# EAGLE design R601F (EAGLE 6.6.0)
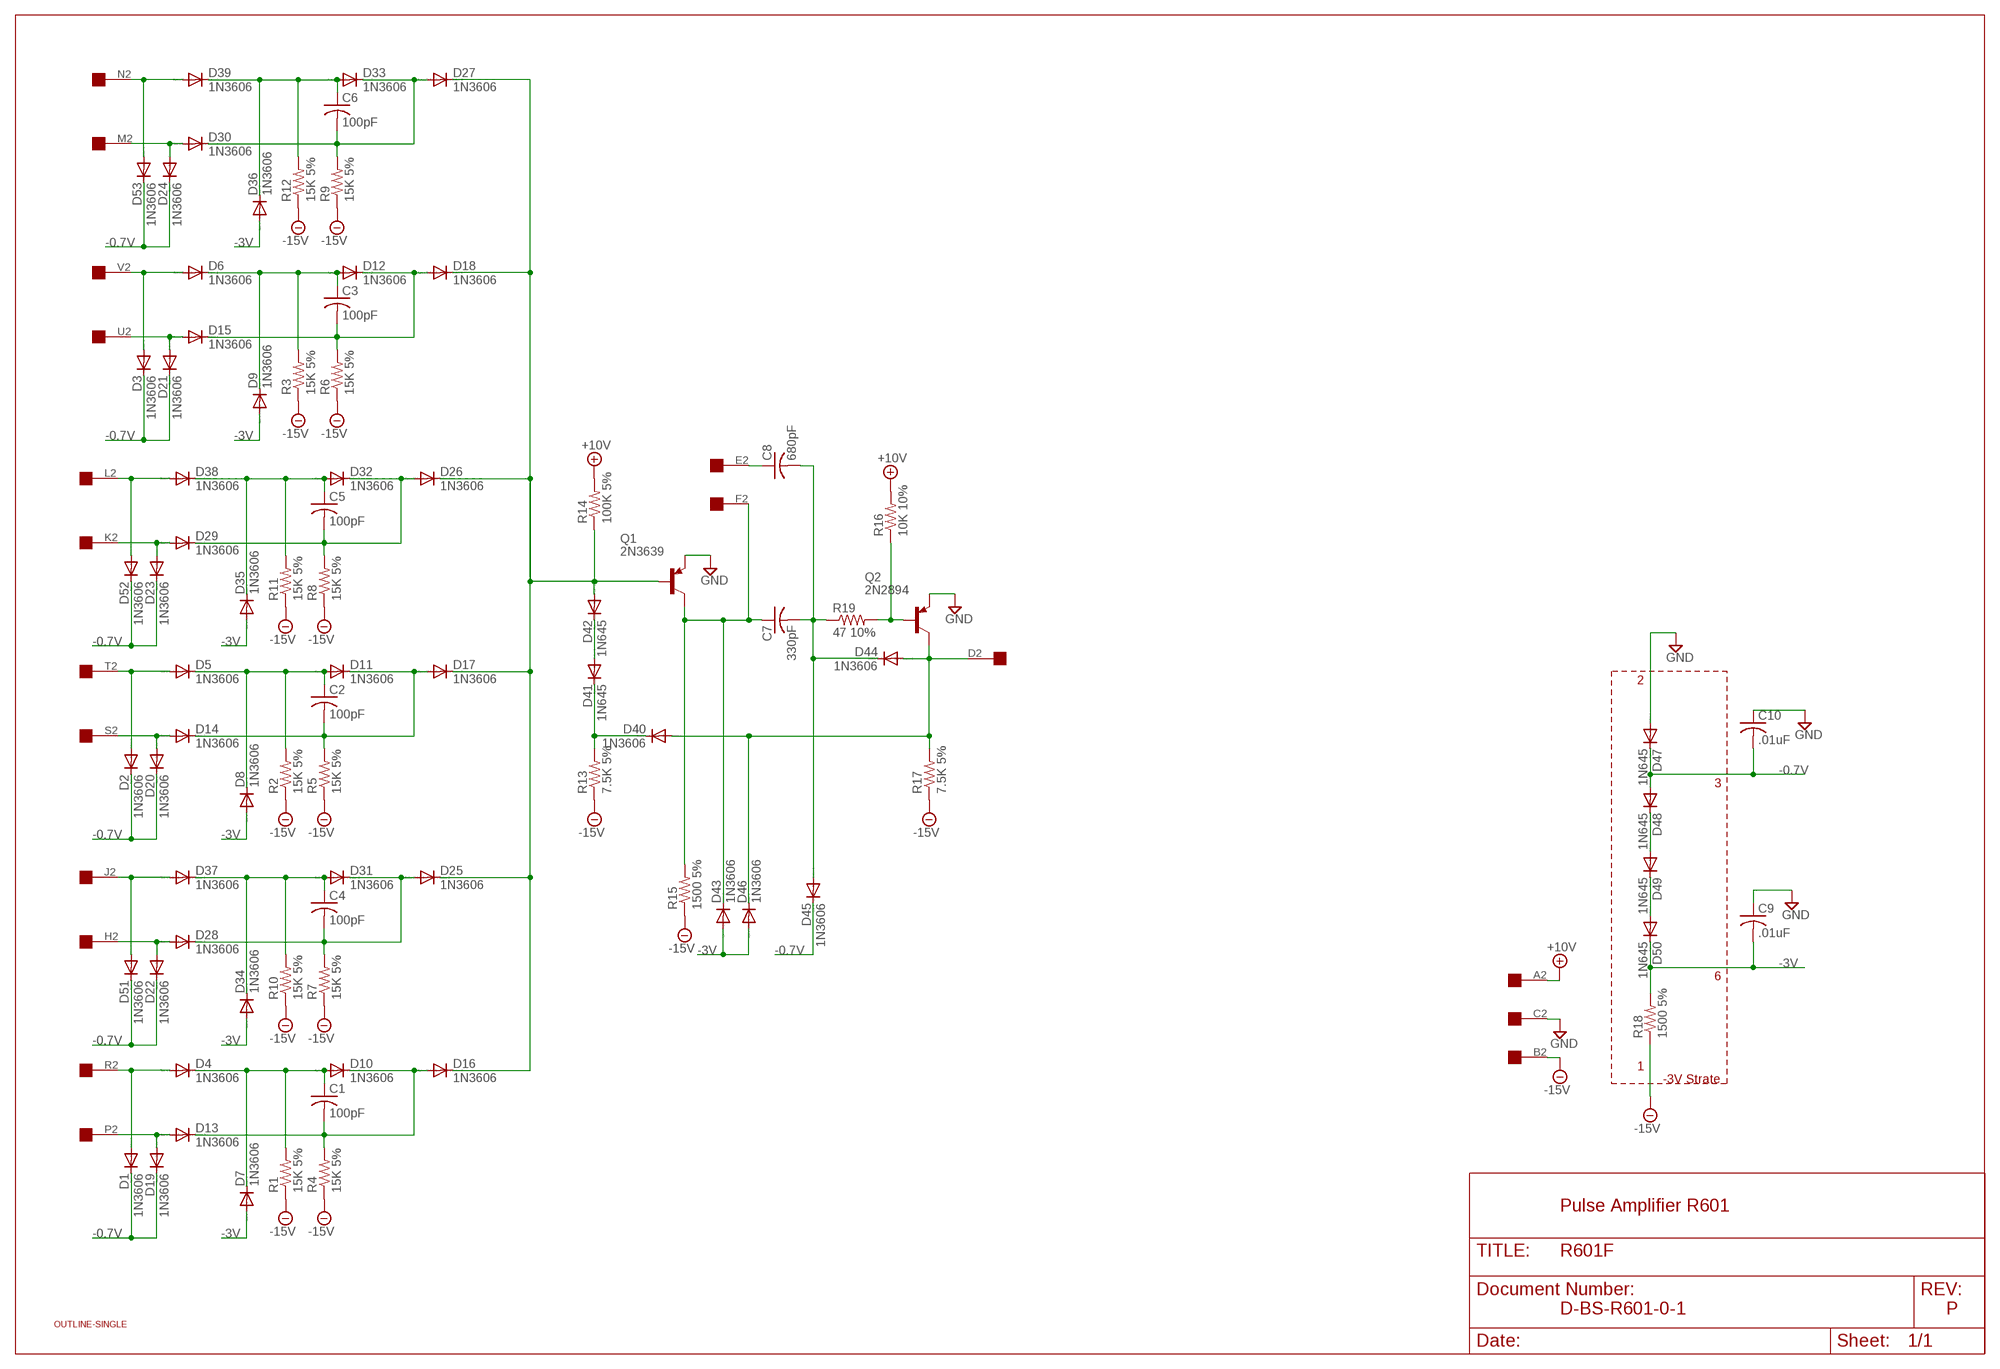
[diagram p0: schematic, sheet 1]

## Parts
C1  100pF  C-US050-025X075  [C050-025X075]
C2  100pF  C-US050-025X075  [C050-025X075]
C3  100pF  C-US050-025X075  [C050-025X075]
C4  100pF  C-US050-025X075  [C050-025X075]
C5  100pF  C-US050-025X075  [C050-025X075]
C6  100pF  C-US050-025X075  [C050-025X075]
C7  330pF  C-US050-025X075  [C050-025X075]
C8  680pF  C-US050-025X075  [C050-025X075]
C9  .01uF  C-US050-025X075  [C050-025X075]
C10  .01uF  C-US050-025X075  [C050-025X075]
D1  1N3606  1N4148DO35-10  [DO35-10]
D2  1N3606  1N4148DO35-10  [DO35-10]
D3  1N3606  1N4148DO35-10  [DO35-10]
D4  1N3606  1N4148DO35-10  [DO35-10]
D5  1N3606  1N4148DO35-10  [DO35-10]
D6  1N3606  1N4148DO35-10  [DO35-10]
D7  1N3606  1N4148DO35-10  [DO35-10]
D8  1N3606  1N4148DO35-10  [DO35-10]
D9  1N3606  1N4148DO35-10  [DO35-10]
D10  1N3606  1N4148DO35-10  [DO35-10]
D11  1N3606  1N4148DO35-10  [DO35-10]
D12  1N3606  1N4148DO35-10  [DO35-10]
D13  1N3606  1N4148DO35-10  [DO35-10]
D14  1N3606  1N4148DO35-10  [DO35-10]
D15  1N3606  1N4148DO35-10  [DO35-10]
D16  1N3606  1N4148DO35-10  [DO35-10]
D17  1N3606  1N4148DO35-10  [DO35-10]
D18  1N3606  1N4148DO35-10  [DO35-10]
D19  1N3606  1N4148DO35-10  [DO35-10]
D20  1N3606  1N4148DO35-10  [DO35-10]
D21  1N3606  1N4148DO35-10  [DO35-10]
D22  1N3606  1N4148DO35-10  [DO35-10]
D23  1N3606  1N4148DO35-10  [DO35-10]
D24  1N3606  1N4148DO35-10  [DO35-10]
D25  1N3606  1N4148DO35-10  [DO35-10]
D26  1N3606  1N4148DO35-10  [DO35-10]
D27  1N3606  1N4148DO35-10  [DO35-10]
D28  1N3606  1N4148DO35-10  [DO35-10]
D29  1N3606  1N4148DO35-10  [DO35-10]
D30  1N3606  1N4148DO35-10  [DO35-10]
D31  1N3606  1N4148DO35-10  [DO35-10]
D32  1N3606  1N4148DO35-10  [DO35-10]
D33  1N3606  1N4148DO35-10  [DO35-10]
D34  1N3606  1N4148DO35-10  [DO35-10]
D35  1N3606  1N4148DO35-10  [DO35-10]
D36  1N3606  1N4148DO35-10  [DO35-10]
D37  1N3606  1N4148DO35-10  [DO35-10]
D38  1N3606  1N4148DO35-10  [DO35-10]
D39  1N3606  1N4148DO35-10  [DO35-10]
D40  1N3606  1N4148DO35-10  [DO35-10]
D41  1N645  1N4148DO35-10  [DO35-10]
D42  1N645  1N4148DO35-10  [DO35-10]
D43  1N3606  1N4148DO35-10  [DO35-10]
D44  1N3606  1N4148DO35-10  [DO35-10]
D45  1N3606  1N4148DO35-10  [DO35-10]
D46  1N3606  1N4148DO35-10  [DO35-10]
D47  1N645  1N4148DO35-10  [DO35-10]
D48  1N645  1N4148DO35-10  [DO35-10]
D49  1N645  1N4148DO35-10  [DO35-10]
D50  1N645  1N4148DO35-10  [DO35-10]
D51  1N3606  1N4148DO35-10  [DO35-10]
D52  1N3606  1N4148DO35-10  [DO35-10]
D53  1N3606  1N4148DO35-10  [DO35-10]
Q1  2N3639  2N2904  [TO39]
Q2  2N2894  2N2904  [TO39]
R1  15K 5%  R-US_0207/10  [0207/10]
R2  15K 5%  R-US_0207/10  [0207/10]
R3  15K 5%  R-US_0207/10  [0207/10]
R4  15K 5%  R-US_0207/10  [0207/10]
R5  15K 5%  R-US_0207/10  [0207/10]
R6  15K 5%  R-US_0207/10  [0207/10]
R7  15K 5%  R-US_0207/10  [0207/10]
R8  15K 5%  R-US_0207/10  [0207/10]
R9  15K 5%  R-US_0207/10  [0207/10]
R10  15K 5%  R-US_0207/10  [0207/10]
R11  15K 5%  R-US_0207/10  [0207/10]
R12  15K 5%  R-US_0207/10  [0207/10]
R13  7.5K 5%  R-US_0207/10  [0207/10]
R14  100K 5%  R-US_0207/10  [0207/10]
R15  1500 5%  R-US_0207/10  [0207/10]
R16  10K 10%  R-US_0207/10  [0207/10]
R17  7.5K 5%  R-US_0207/10  [0207/10]
R18  1500 5%  R-US_0207/10  [0207/10]
R19  47 10%  R-US_0207/10  [0207/10]
U$1  OUTLINE-SINGLE  [SINGLE]
U$2  EDGE-1  [EDGE-CON1]

## Nets
+10V [Supply]: R14.2 R16.2 U$2.A2
-0.7V [Supply]: C10.2 D1.C D2.C D3.C D19.C D20.C D21.C D22.C D23.C D24.C D45.C D47.C D48.A D51.C D52.C D53.C
-3V [Supply]: C9.2 D7.A D8.A D9.A D34.A D35.A D36.A D43.A D46.A D50.C R18.2
-15V [Supply]: R1.1 R2.1 R3.1 R4.1 R5.1 R6.1 R7.1 R8.1 R9.1 R10.1 R11.1 R12.1 R13.1 R15.1 R17.1 R18.1 U$2.B2
GND [Supply]: C9.1 C10.1 D47.A Q1.1(E) Q2.1(E) U$2.C2
N$1: D37.A D51.A U$2.J2
N$2: D40.C D41.C R13.2
N$3: D39.A D53.A U$2.N2
N$4: D24.A D30.A U$2.M2
N$5: C6.1 D33.A D36.C D39.C R12.2
N$6: C6.2 D27.A D30.C D33.C R9.2
N$7: D41.A D42.C
N$8 [Supply]: D48.C D49.A
N$9 [Supply]: D49.C D50.A
N$10: D16.C D17.C D18.C D25.C D26.C D27.C D42.A Q1.2(B) R14.1
N$11: C7.1 D43.C Q1.3(C) R15.2 U$2.F2
N$12: C7.2 C8.2 D44.C D45.A R19.1
N$13: Q2.2(B) R16.1 R19.2
N$14: D40.A D44.A D46.C Q2.3(C) R17.2 U$2.D2
N$15: D3.A D6.A U$2.V2
N$16: D15.A D21.A U$2.U2
N$17: C3.1 D6.C D9.C D12.A R3.2
N$18: C3.2 D12.C D15.C D18.A R6.2
N$19: D38.A D52.A U$2.L2
N$20: D23.A D29.A U$2.K2
N$21: C5.1 D32.A D35.C D38.C R11.2
N$22: C5.2 D26.A D29.C D32.C R8.2
N$23: D22.A D28.A U$2.H2
N$24: C4.1 D31.A D34.C D37.C R10.2
N$25: C4.2 D25.A D28.C D31.C R7.2
N$26: D1.A D4.A U$2.R2
N$27: D13.A D19.A U$2.P2
N$28: C1.1 D4.C D7.C D10.A R1.2
N$29: C1.2 D10.C D13.C D16.A R4.2
N$30: C8.1 U$2.E2
N$31: D2.A D5.A U$2.T2
N$32: D14.A D20.A U$2.S2
N$33: C2.1 D5.C D8.C D11.A R2.2
N$34: C2.2 D11.C D14.C D17.A R5.2

## Notes on the sheet
- 2
- 3
- 6
- 1
- -3V Strate
- Pulse Amplifier R601
- D-BS-R601-0-1 | P

## Library data of the parts
C1-C10 = rcl:C-US: CAPACITOR, American symbol
D1-D53 = diode:1N4148: DIODE high speed (Philips)
Q1 Q2 = transistor-pnp:2N2904*: PNP Transistror
R1-R19 = rcl:R-US_: RESISTOR, American symbol
U$1 = dec-con:OUTLINE-*: Board outlines for DEC boards.
U$2 = dec-con:EDGE-1: Single-Sided DEC Edge Connector -- (side 2)

## Net classes
1 Supply: width 0.813 mm

## Board
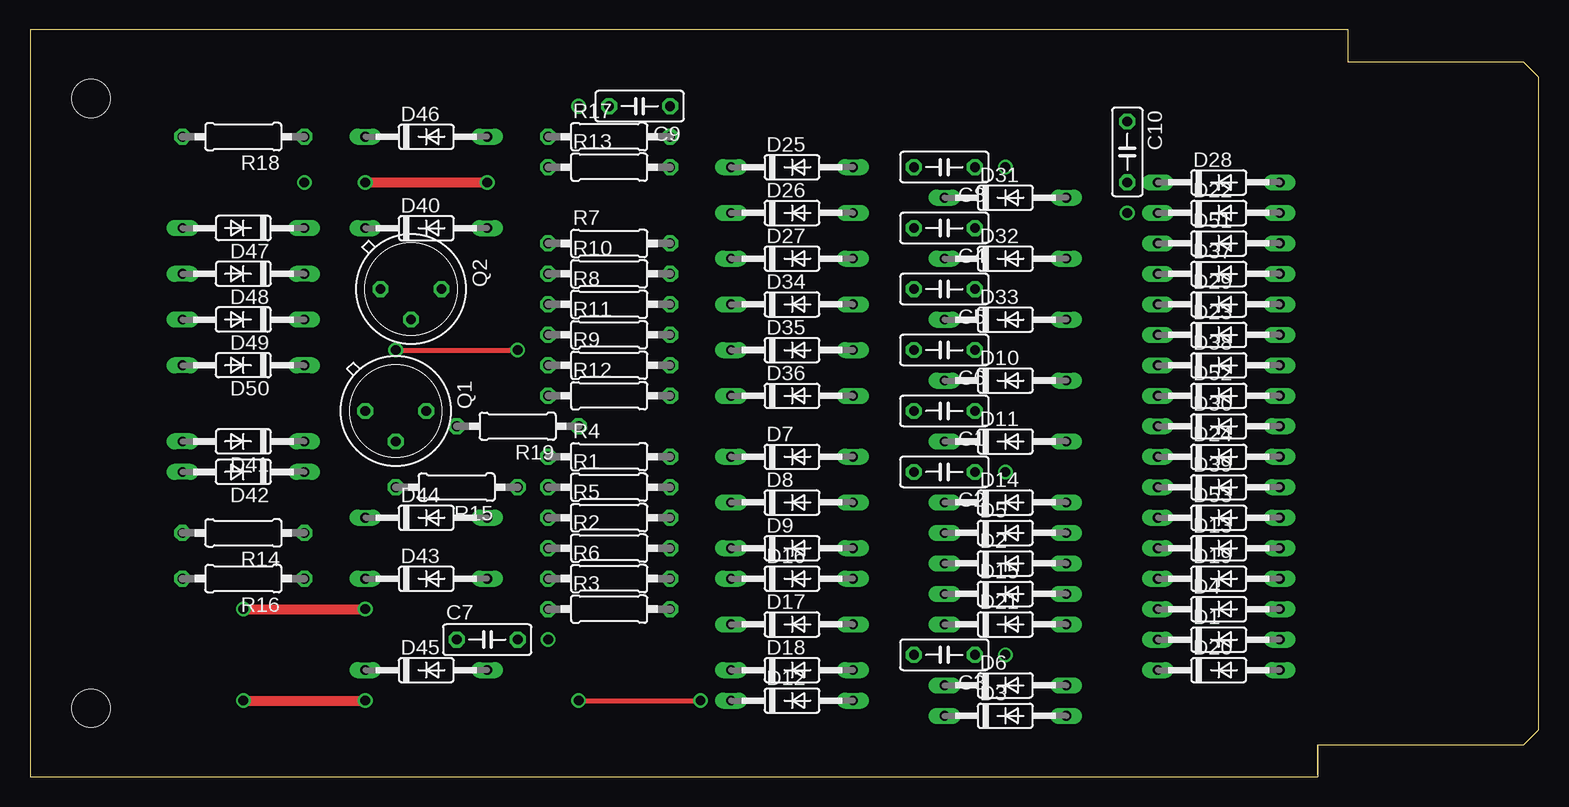
[diagram p1: board, top side]
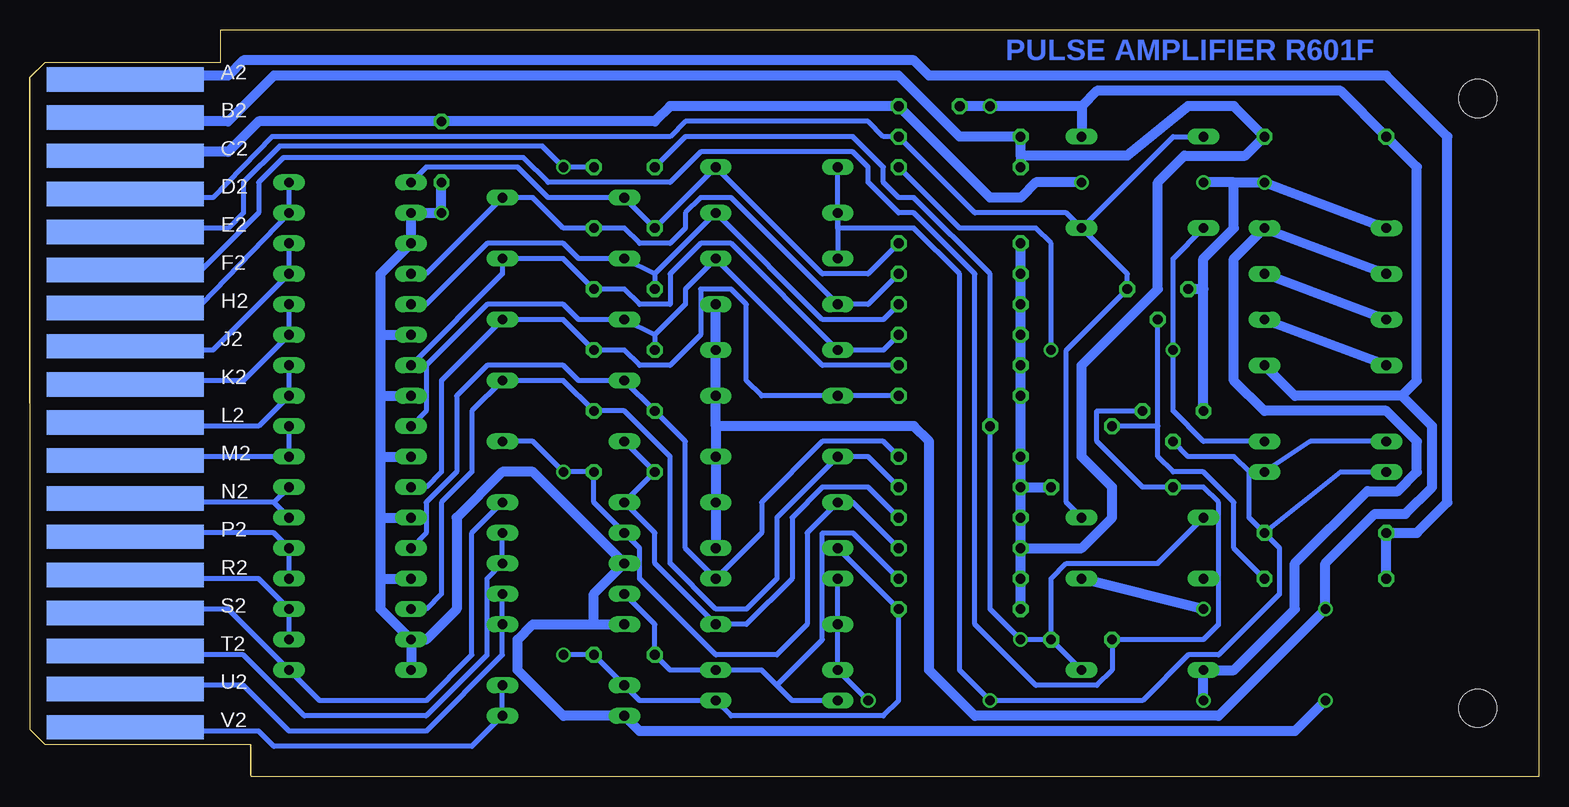
[diagram p2: board, bottom side, seen from below]

Size 125.73 x 62.23 mm. Coordinates in mm from the lower left corner, seen from the top.
Copper layers (1+16): Top 0.035mm / dielectric 1.5mm / Bottom 0.035mm
Design rules "16mils": minimum track width 16mil, minimum drill 32mil, track to track 15mil, track to pad 10mil, pad to pad 10mil, via to via 10mil, smd to smd 10mil, copper to edge 13mil, drill to drill 10mil, minimum pad ring 10mil, minimum via ring 8mil, stop-mask expansion 0mil, vias tented up to drill 0mil, thermal gap 10mil

### Footprints (pad centres in the part's own frame; a part is rotated, then mirrored left to right if it is on the bottom)
C050-025X075 = drill 0.813 octagon: 1 -2.54,0; 2 2.54,0
DO35-10 = drill 0.813 long: A 5.08,0; C -5.08,0
TO39 = drill 0.813 octagon: 1 0,-2.54; 2 2.54,0; 3 0,2.54
0207/10 = drill 0.813 octagon: 1 -5.08,0; 2 5.08,0
SINGLE = hole 3.175: 120.65,56.515; 120.65,5.715
EDGE-CON1 = smd 13.106 x 2.032 bottom: A2 7.938,4.128; B2 7.938,7.303; C2 7.938,10.477; D2 7.938,13.652; E2 7.938,16.828; F2 7.938,20.003; H2 7.938,23.177; J2 7.938,26.352; K2 7.938,29.527; L2 7.938,32.703; M2 7.938,35.877; N2 7.938,39.053; P2 7.938,42.227; R2 7.938,45.403; S2 7.938,48.578; T2 7.938,51.752; U2 7.938,54.928; V2 7.938,58.102

### Placement (x,y rotation side)
C1  76.2,30.48 180 top
C2  76.2,25.4 180 top
C3  76.2,10.16 180 top
C4  76.2,45.72 180 top
C5  76.2,40.64 180 top
C6  76.2,35.56 180 top
C7  38.1,11.43 0 top
C8  76.2,50.8 180 top
C9  50.8,55.88 180 top
C10  91.44,52.07 270 top
D1  99.06,11.43 0 top
D2  81.28,17.78 0 top
D3  81.28,5.08 0 top
D4  99.06,13.97 0 top
D5  81.28,20.32 0 top
D6  81.28,7.62 0 top
D7  63.5,26.67 0 top
D8  63.5,22.86 0 top
D9  63.5,19.05 0 top
D10  81.28,33.02 0 top
D11  81.28,27.94 0 top
D12  63.5,6.35 0 top
D13  99.06,19.05 0 top
D14  81.28,22.86 0 top
D15  81.28,15.24 0 top
D16  63.5,16.51 0 top
D17  63.5,12.7 0 top
D18  63.5,8.89 0 top
D19  99.06,16.51 0 top
D20  99.06,8.89 0 top
D21  81.28,12.7 0 top
D22  99.06,46.99 0 top
D23  99.06,36.83 0 top
D24  99.06,26.67 0 top
D25  63.5,50.8 0 top
D26  63.5,46.99 0 top
D27  63.5,43.18 0 top
D28  99.06,49.53 0 top
D29  99.06,39.37 0 top
D30  99.06,29.21 0 top
D31  81.28,48.26 0 top
D32  81.28,43.18 0 top
D33  81.28,38.1 0 top
D34  63.5,39.37 0 top
D35  63.5,35.56 0 top
D36  63.5,31.75 0 top
D37  99.06,41.91 0 top
D38  99.06,34.29 0 top
D39  99.06,24.13 0 top
D40  33.02,45.72 0 top
D41  17.78,27.94 180 top
D42  17.78,25.4 180 top
D43  33.02,16.51 0 top
D44  33.02,21.59 0 top
D45  33.02,8.89 0 top
D46  33.02,53.34 0 top
D47  17.78,45.72 180 top
D48  17.78,41.91 180 top
D49  17.78,38.1 180 top
D50  17.78,34.29 180 top
D51  99.06,44.45 0 top
D52  99.06,31.75 0 top
D53  99.06,21.59 0 top
Q1  30.48,30.48 270 top
Q2  31.75,40.64 270 top
R1  48.26,24.13 0 top
R2  48.26,19.05 0 top
R3  48.26,13.97 0 top
R4  48.26,26.67 0 top
R5  48.26,21.59 0 top
R6  48.26,16.51 0 top
R7  48.26,44.45 0 top
R8  48.26,39.37 0 top
R9  48.26,34.29 0 top
R10  48.26,41.91 0 top
R11  48.26,36.83 0 top
R12  48.26,31.75 0 top
R13  48.26,50.8 0 top
R14  17.78,20.32 180 top
R15  35.56,24.13 180 top
R16  17.78,16.51 180 top
R17  48.26,53.34 0 top
R18  17.78,53.34 180 top
R19  40.64,29.21 180 top
U$1  125.73,62.23 180 top
U$2  125.73,62.23 180 top

### Tracks (layer width: path | path; a pad name or v marks a point on that pad's centre or on a via)
+10V
  Bottom 0.813: U$2.A2 117.22,58.04 116.84,58.42 109.22,58.42 107.95,59.69 52.07,59.69 50.8,58.42 12.7,58.42 7.62,53.34 7.62,22.86 10.16,20.32 R14.2 | R16.2 R14.2 | R16.2 R14.2 | R16.2 R14.2
-0.7V  (via drill 0.81)
  Top 0.813: v17.78,6.35 v27.94,6.35
  Bottom 0.813: D1.C D20.C | D1.C 96.52,13.97 96.52,16.51 | 96.52,16.51 96.52,21.59 | 96.52,21.59 96.52,26.67 | 96.52,26.67 96.52,31.75 | 96.52,31.75 96.52,36.83 | 96.52,36.83 96.52,41.91 D51.C D22.C v91.44,46.99 C10.2 | 96.52,36.83 D23.C | 96.52,31.75 D52.C | 96.52,26.67 D24.C | 96.52,21.59 D53.C | 96.52,16.51 D19.C | D1.C 92.71,11.43 90.17,13.97 90.17,21.59 86.36,25.4 83.82,25.4 D2.C 78.74,15.24 78.74,12.7 | 78.74,12.7 83.82,12.7 85.09,11.43 85.09,8.89 81.28,5.08 D3.C 74.93,3.81 20.32,3.81 v17.78,6.35 | 78.74,12.7 D21.C | D48.A D47.C 25.4,43.18 25.4,33.02 22.86,30.48 12.7,30.48 10.16,27.94 10.16,25.4 11.75,23.81 14.29,23.81 20.32,17.78 20.32,13.97 25.4,8.89 D45.C v27.94,6.35
-3V  (via drill 0.81)
  Top 0.813: v17.78,13.97 v27.94,13.97
  Bottom 0.813: D34.A D35.A D36.A 68.58,29.21 | 68.58,29.21 D7.A D8.A D9.A | 68.58,29.21 52.07,29.21 50.8,27.94 50.8,8.89 46.99,5.08 26.67,5.08 v17.78,13.97 17.78,17.78 13.65,21.91 11.11,21.91 8.89,24.13 8.89,29.21 11.43,31.75 | C9.2 v45.72,55.88 38.1,55.88 | D50.C 20.32,31.75 11.43,31.75 | 11.43,31.75 10.16,33.02 10.16,50.8 R18.2 16.51,57.15 36.83,57.15 38.1,55.88 | 38.1,55.88 D46.A | v27.94,13.97 D43.A
-15V
  Bottom 0.813: U$2.B2 117.13,54.9 116.84,54.61 109.22,54.61 105.41,58.42 53.34,58.42 48.26,53.34 R17.1 43.18,51.75 | R3.1 R6.1 R2.1 | R2.1 R5.1 R1.1 | R1.1 R4.1 R12.1 R9.1 R11.1 R8.1 R10.1 R7.1 | R1.1 R15.1 | 43.18,51.75 34.29,51.75 29.21,55.88 25.4,55.88 R18.1 24.45,51.75 29.53,51.75 31.75,49.53 31.75,40.64 38.1,34.29 38.1,26.67 35.56,24.13 35.56,21.59 38.1,19.05 R2.1 | 43.18,51.75 R13.1
GND  (via drill 0.81)
  Top 0.813: v27.94,49.53 v38.1,49.53
  Bottom 0.813: U$2.C2 117.17,51.74 116.84,52.07 109.22,52.07 106.68,54.61 C10.1 73.66,54.61 72.39,55.88 C9.1 45.72,48.26 43.18,48.26 41.91,49.53 v38.1,49.53 | D47.A v22.86,49.53 25.4,49.53 | 27.94,40.64 27.94,43.18 25.4,45.72 25.4,49.53 | 25.4,49.53 v27.94,49.53 | Q1.1 27.94,40.64 | 27.94,40.64 Q2.1
N$1
  Bottom 0.406: U$2.J2 117.17,35.89 116.84,35.56 110.49,35.56 D37.A D51.A
N$2  (via drill 0.81)
  Top 0.406: v30.48,35.56 v40.64,35.56
  Bottom 0.406: R13.2 48.26,45.72 41.91,45.72 40.64,44.45 v40.64,35.56 | D40.C 30.48,43.18 v30.48,35.56 30.48,30.48 27.94,27.94 D41.C
N$3
  Bottom 0.406: U$2.N2 117.17,23.19 116.84,22.86 105.41,22.86 | D53.A 105.41,22.86 | 105.41,22.86 D39.A
N$4
  Bottom 0.406: U$2.M2 117.17,26.34 116.84,26.67 D24.A D30.A
N$5
  Bottom 0.406: D39.C 92.71,24.13 91.44,25.4 91.44,33.02 D33.A 81.28,38.1 C6.1 76.2,35.56 74.93,34.29 72.39,34.29 69.85,36.83 69.85,40.64 67.31,40.64 66.04,39.37 66.04,33.02 64.77,31.75 D36.C R12.2
N$6
  Bottom 0.406: D30.C 92.71,30.48 92.71,34.29 87.63,39.37 81.28,39.37 80.01,38.1 D33.C 73.66,36.83 | 73.66,36.83 71.12,39.37 71.12,40.64 D27.A 59.69,34.29 R9.2 | 73.66,36.83 C6.2
N$7
  Bottom 0.406: D41.A 19.05,27.94 D42.C
N$8
  Bottom 0.813: D49.A D48.C
N$9
  Bottom 0.813: D50.A D49.C
N$10  (via drill 0.81)
  Top 0.406: v45.72,6.35 v55.88,6.35
  Bottom 0.406: D16.C D17.C D18.C v55.88,6.35 | D26.C D25.C | D26.C D27.C | D26.C 58.42,45.72 52.07,45.72 48.26,41.91 48.26,8.89 v45.72,6.35 33.02,6.35 29.21,10.16 26.67,10.16 21.59,15.24 21.59,19.05 R14.1 | D42.A 16.51,25.4 R14.1 | R14.1 24.13,21.59 24.13,25.4 25.4,26.67 29.21,26.67 Q1.2
N$11
  Bottom 0.406: U$2.F2 117.12,42.19 116.84,41.91 111.76,41.91 106.68,46.99 106.68,49.53 104.62,51.59 84.61,51.59 82.55,49.53 72.39,49.53 69.85,52.07 57.15,52.07 55.88,50.8 55.88,49.53 53.34,46.99 52.07,46.99 46.99,41.91 46.99,12.7 41.91,7.62 36.83,7.62 35.56,8.89 C7.1 27.94,11.43 26.67,12.7 26.67,16.51 | Q1.3 36.83,30.48 36.83,27.94 33.02,24.13 R15.2 27.94,24.13 26.67,22.86 26.67,16.51 | 26.67,16.51 D43.C
N$12  (via drill 0.81)
  Bottom 0.406: C8.2 71.12,53.34 57.15,53.34 54.61,50.8 54.61,49.53 53.34,48.26 52.07,48.26 45.72,41.91 R19.1 45.72,13.97 v43.18,11.43 C7.2 | D44.C 31.75,17.78 39.37,17.78 40.64,16.51 C7.2 | D45.A C7.2
N$13
  Bottom 0.406: 31.75,29.21 Q2.2 | 31.75,29.21 R19.2 | R16.1 25.4,19.05 25.4,22.86 27.94,25.4 30.48,25.4 31.75,26.67 31.75,29.21
N$14
  Bottom 0.406: U$2.D2 117.14,48.56 116.84,48.26 110.49,48.26 105.57,53.34 72.39,53.34 71.12,54.61 55.88,54.61 54.61,53.34 R17.2 46.99,46.99 39.37,46.99 D40.A | D40.A 30.48,53.34 D46.C | D40.A 34.29,41.91 Q2.3 39.37,35.56 39.37,22.86 D44.A
N$15
  Bottom 0.406: U$2.V2 117.16,4.13 116.84,3.81 106.68,3.81 105.41,2.54 88.9,2.54 D3.A D6.A
N$16
  Bottom 0.406: U$2.U2 117.2,7.26 116.84,7.62 107.95,7.62 104.14,3.81 92.71,3.81 86.36,10.16 D21.A D15.A
N$17  (via drill 0.81)
  Bottom 0.406: v81.28,10.16 C3.1 D6.C 74.93,6.35 D12.A 67.31,5.08 54.61,5.08 53.34,6.35 R3.2 D9.C
N$18
  Bottom 0.406: D15.C 73.66,12.7 C3.2 72.39,8.89 D18.A 64.77,8.89 63.5,7.62 | D12.C 62.23,6.35 63.5,7.62 | R6.2 57.15,20.32 59.69,20.32 59.69,11.43 63.5,7.62
N$19
  Bottom 0.406: U$2.L2 117.17,29.54 116.84,29.21 106.68,29.21 D52.A D38.A
N$20
  Bottom 0.406: U$2.K2 117.14,32.72 116.84,33.02 107.95,33.02 D23.A D29.A
N$21
  Bottom 0.406: D38.C 86.36,41.91 D32.A 81.28,43.18 C5.1 76.2,40.64 74.93,39.37 72.39,39.37 72.39,41.91 69.85,44.45 67.31,44.45 D35.C 54.61,35.56 R11.2
N$22
  Bottom 0.406: D29.C 92.71,39.37 87.63,44.45 81.28,44.45 80.01,43.18 D32.C 73.66,41.91 | 73.66,41.91 D26.A 59.69,38.1 54.61,38.1 R8.2 | 73.66,41.91 C5.2
N$23
  Bottom 0.406: U$2.H2 117.17,39.04 116.84,39.37 111.44,39.37 D22.A D28.A
N$24
  Bottom 0.406: D37.C 92.71,41.91 D31.A 83.82,48.26 81.28,45.72 C4.1 76.2,45.72 74.93,44.45 72.39,44.45 71.12,45.72 71.12,46.99 69.85,48.26 67.31,48.26 D34.C 55.88,39.37 R10.2
N$25
  Bottom 0.406: D28.C 92.71,50.8 85.09,50.8 82.55,48.26 D31.C C4.2 D25.A 59.69,41.91 55.88,41.91 R7.2
N$26
  Bottom 0.406: U$2.R2 117.17,16.84 116.84,16.51 106.68,16.51 D4.A D1.A
N$27
  Bottom 0.406: U$2.P2 117.17,19.99 116.84,20.32 105.41,20.32 D13.A D19.A
N$28
  Bottom 0.406: D4.C 92.71,13.97 91.44,15.24 91.44,22.86 88.9,25.4 88.9,30.48 D10.A 81.28,33.02 C1.1 76.2,30.48 72.39,26.67 72.39,17.78 68.58,13.97 66.04,13.97 63.5,16.51 63.5,21.59 D7.C 55.88,26.67 R1.2
N$29
  Bottom 0.406: D13.C 92.71,20.32 92.71,22.86 90.17,25.4 90.17,31.75 87.63,34.29 81.28,34.29 80.01,33.02 D10.C C1.2 71.12,27.94 71.12,19.05 D16.A 64.77,20.32 64.77,22.86 59.69,27.94 54.61,27.94 R4.2
N$30  (via drill 0.81)
  Bottom 0.406: U$2.E2 117.17,45.39 116.84,45.72 109.22,45.72 107.95,46.99 107.95,49.53 104.93,52.55 83.03,52.55 v81.28,50.8 C8.1
N$31
  Bottom 0.406: U$2.T2 117.17,10.49 116.84,10.16 107.95,10.16 102.87,5.08 92.71,5.08 87.63,10.16 87.63,16.51 D2.A D5.A
N$32
  Bottom 0.406: U$2.S2 116.84,13.66 116.84,13.97 109.22,13.97 D20.A 101.6,6.35 92.71,6.35 88.9,10.16 88.9,20.32 D14.A
N$33  (via drill 0.81)
  Bottom 0.406: D11.A 83.82,27.94 v81.28,25.4 C2.1 78.74,22.86 D5.C 74.93,19.05 74.93,16.51 68.58,10.16 63.5,10.16 60.96,12.7 60.96,20.32 D8.C 57.15,22.86 R2.2
N$34
  Bottom 0.406: D11.C C2.2 D14.C 73.66,20.32 73.66,17.78 D17.A 66.04,12.7 62.23,16.51 62.23,21.59 59.69,24.13 55.88,24.13 R5.2

### Text on the board
Bottom: PULSE AMPLIFIER R601F